# EasyEDA schematic SCH_超级电容测控板3.json

## Sheets
1 Sheet_1: TITLE: Sheet_1; REV: 1.0; Date: 2022-09-17; Sheet: 1/1; Drawn By: liuyiheng; Company: Your Company
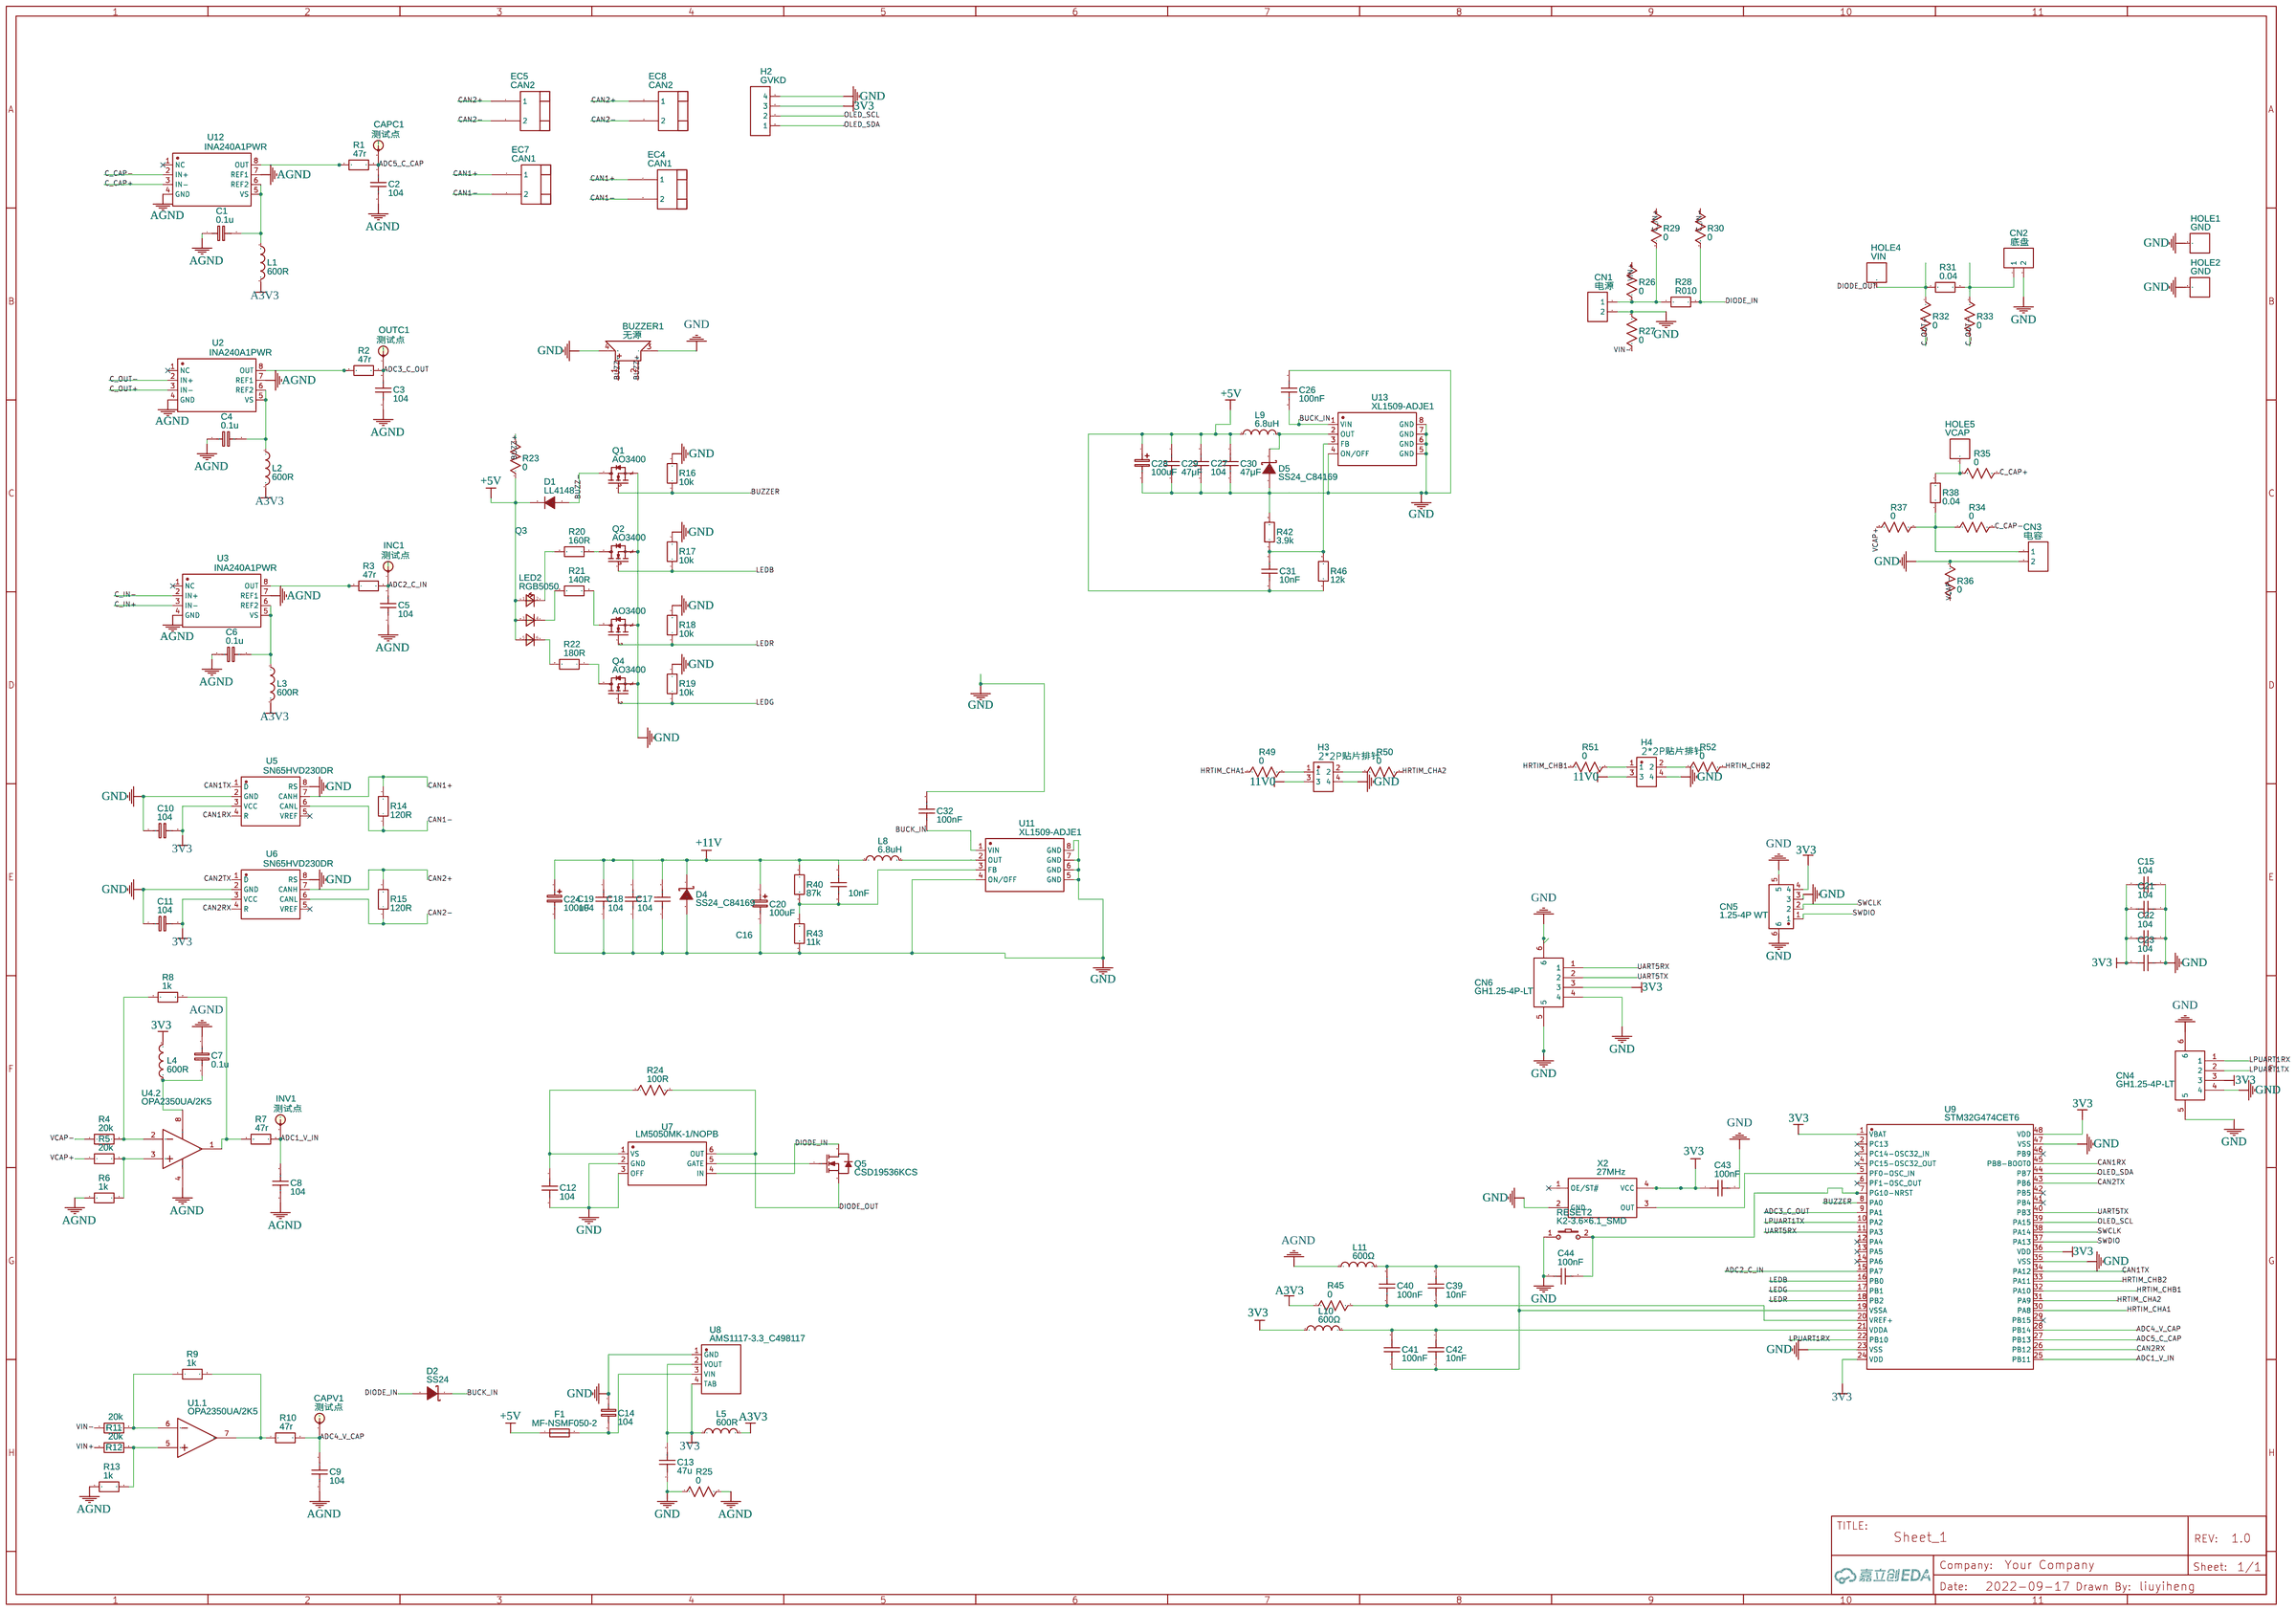
[diagram p0: Sheet_1]
2 参考DCDC: Date: 2021-09-21; Drawn By: sunhaoqin
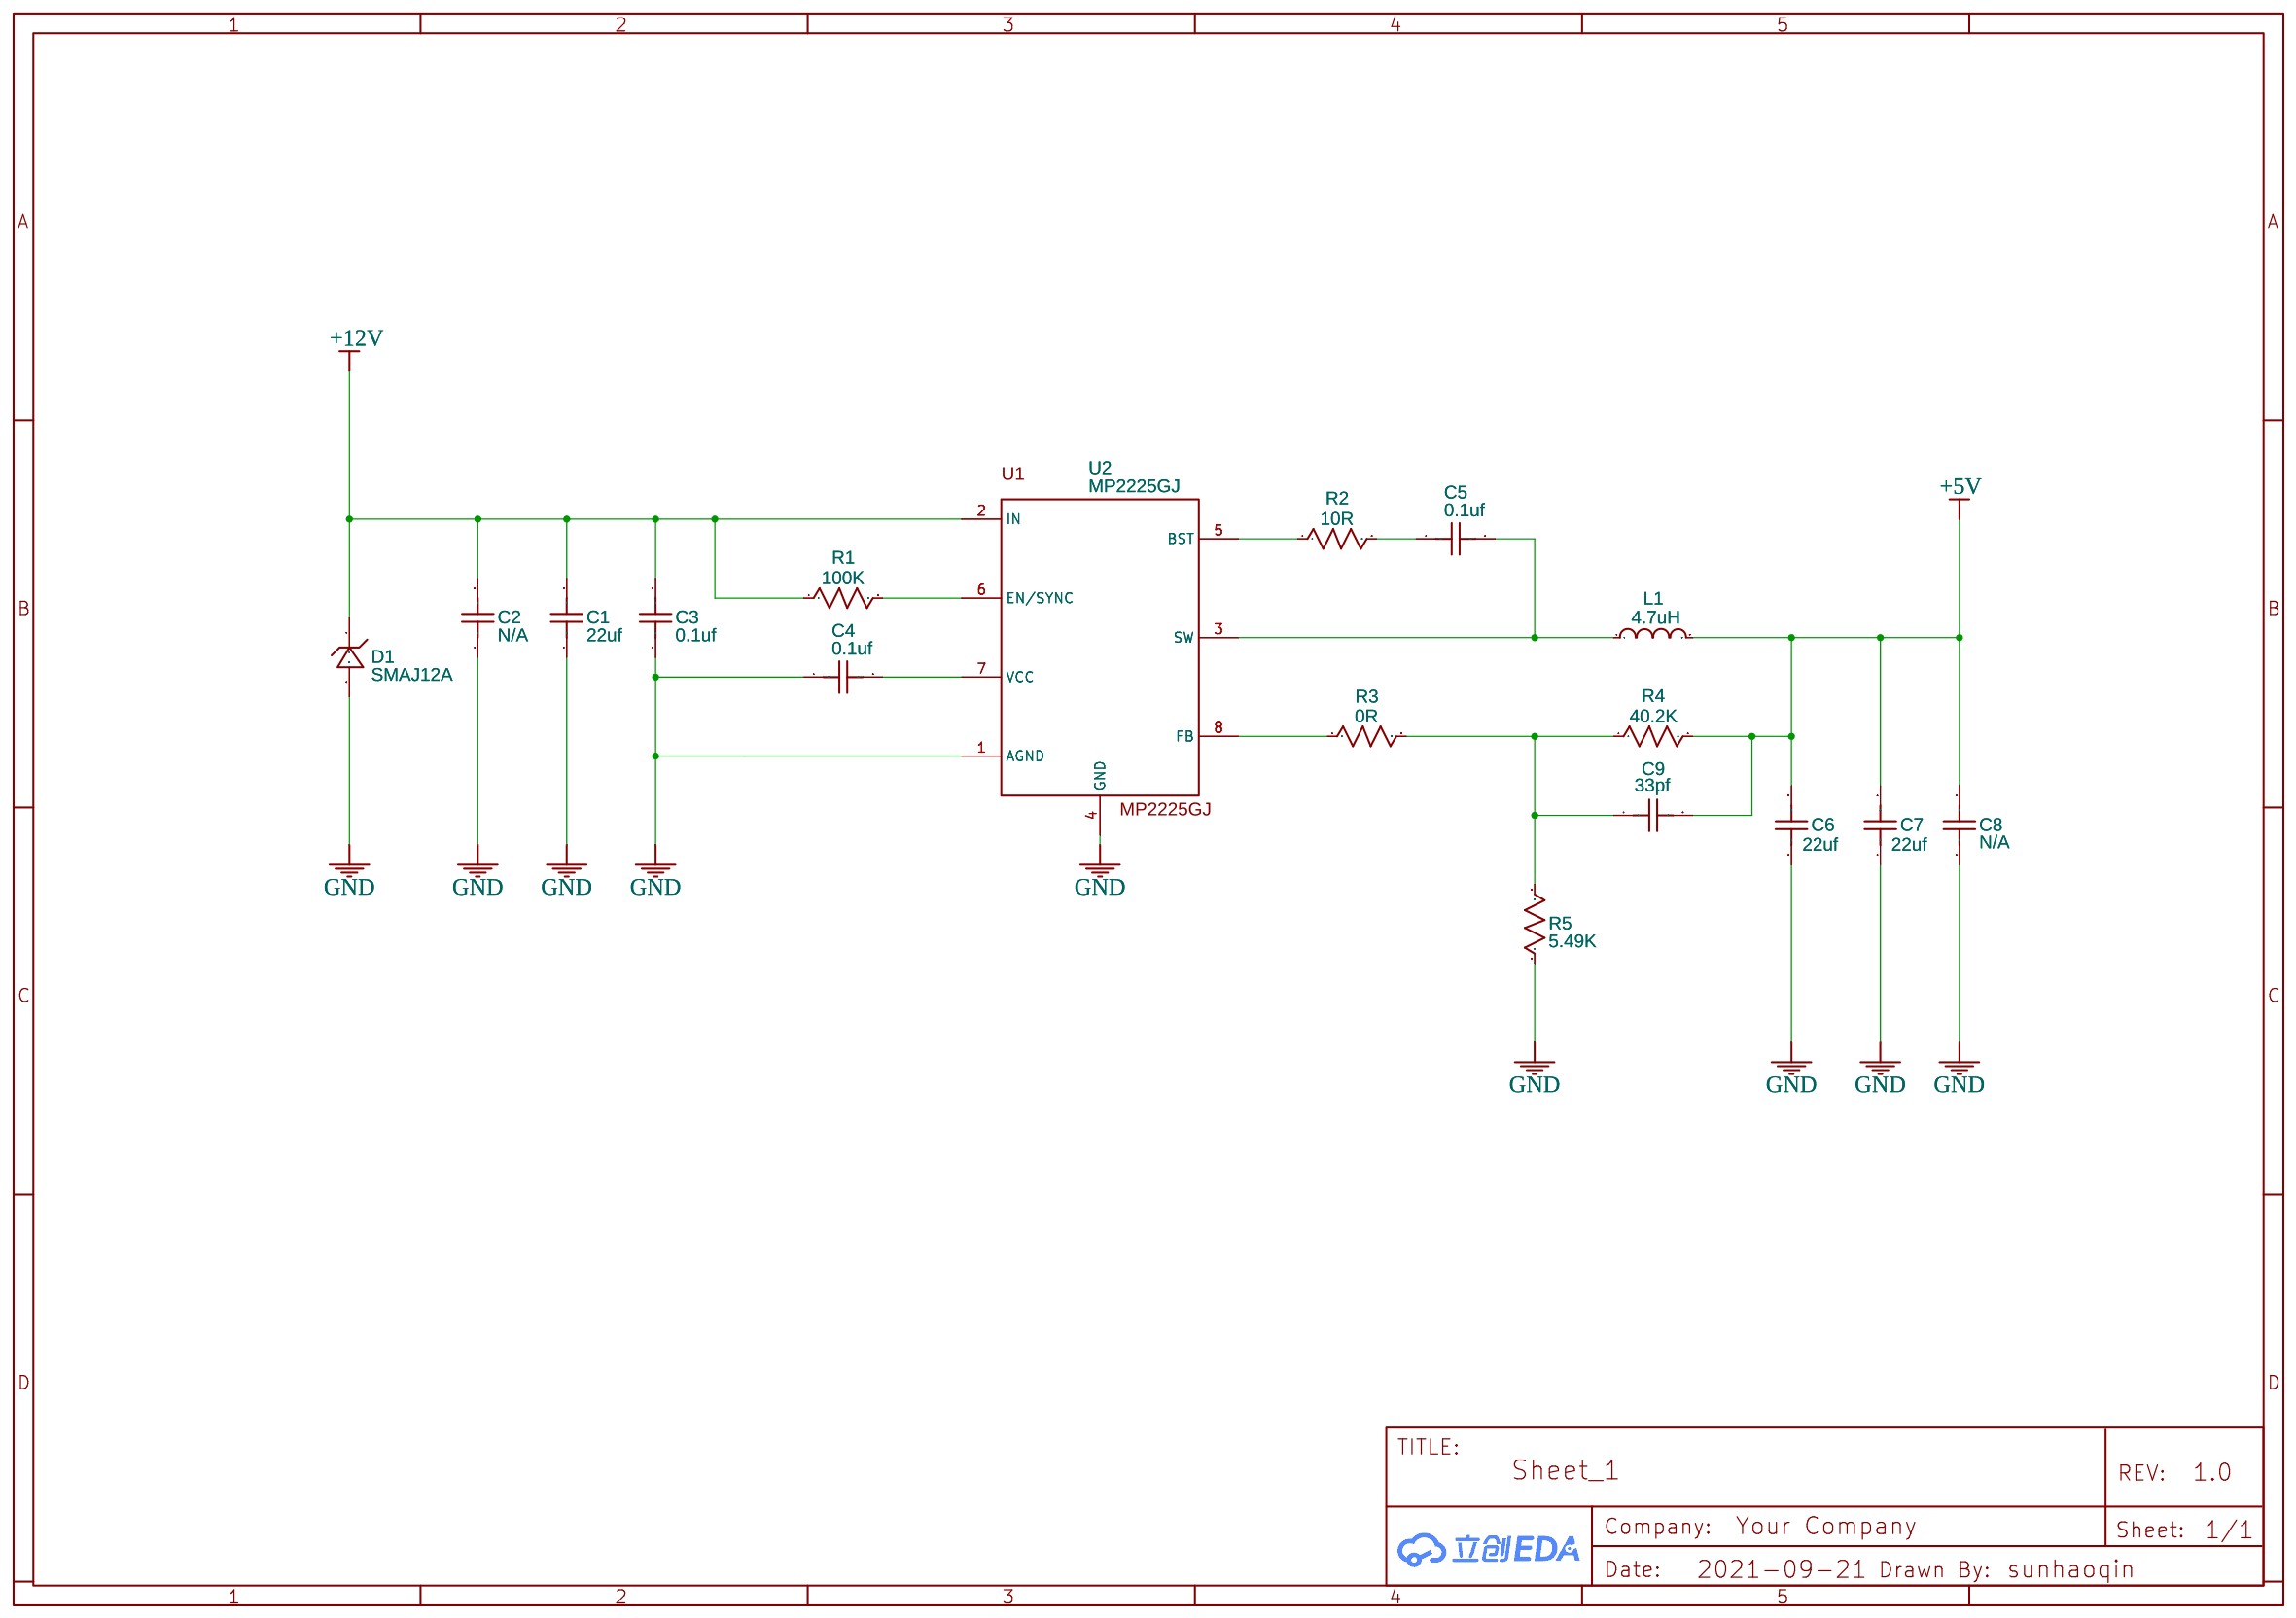
[diagram p1: 参考DCDC]

## Parts
sheet Sheet_1
BUZZER1  无源  [BUZ-SMD_GSC85XX]
C1  0.1u  [C0603]
C2  104  [C0603]
C3  104  [C0603]
C4  0.1u  [C0603]
C5  104  [C0603]
C6  0.1u  [C0603]
C7  0.1u  [C0603]
C8  104  [C0603]
C9  104  [C0603]
C10  104  [C0603]
C11  104  [C0603]
C12  104  [C0603]
C13  47u  [C0603]
C14  104  [C0603]
C15  104  [C0603]
C16  10nF  [C0603]
C17  104  [C0603]
C18  104  [C0603]
C19  104  [C0603]
C20  100uF  [CAP-SMD_L3.5-W2.8-R-RD]
C21  104  [C0603]
C22  104  [C0603]
C23  104  [C0603]
C24  100uF  [CAP-SMD_L3.5-W2.8-R-RD]
C26  100nF  [C0603]
C27  104  [C0603]
C28  100uF  [CAP-SMD_L3.5-W2.8-R-RD]
C29  47μF  [C0805]
C30  47μF  [C0805]
C31  10nF  [C0603]
C32  100nF  [C0603]
C39  10nF  [C0603]
C40  100nF  [C0603]
C41  100nF  [C0603]
C42  10nF  [C0603]
C43  100nF  [C0603]
C44  100nF  [C0603]
CAPC1  测试点  [TP-1.5MM]
CAPV1  测试点  [TP-1.5MM]
CN1  电源  [CONN-TH_XT30UPB-F]
CN2  底盘  [CONN-TH_XT30UPB-F]
CN3  电容  [CONN-TH_XT30UPB-F]
CN4  GH1.25-4P-LT  [SMD-1.25MM-4P-JST-H4.05]
CN5  1.25-4P WT  [CONN-SMD_1.25-4PWT]
CN6  GH1.25-4P-LT  [SMD-1.25MM-4P-JST-H4.05]
D1  LL4148  [LL-34_L3.5-W1.5-R-RD]
D2  SS24  [SMA_L4.3-W2.6-LS5.2-RD]
D4  SS24_C84169  [DO-214AC_L4.3-W2.7-LS5.3-RD]
D5  SS24_C84169  [DO-214AC_L4.3-W2.7-LS5.3-RD]
EC4  CAN1  [CON_GH1.25-1X2_SMD]
EC5  CAN2  [CON_GH1.25-1X2_SMD]
EC7  CAN1  [CON_GH1.25-1X2_SMD]
EC8  CAN2  [CON_GH1.25-1X2_SMD]
F1  MF-NSMF050-2  [F1206]
H2  GVKD  [HDR-F-2.54_1X4]
H3  2*2P贴片排针  [HDR-SMD_4P-P2.54-V-M-R2-C5-S7.4]
H4  2*2P贴片排针  [HDR-SMD_4P-P2.54-V-M-R2-C5-S7.4]
HOLE1  GND  [HOLE_3MM]
HOLE2  GND  [HOLE_3MM]
HOLE4  VIN  [HOLE_3MM]
HOLE5  VCAP  [HOLE_3MM]
INC1  测试点  [TP-1.5MM]
INV1  测试点  [TP-1.5MM]
L1  600R  [L0603]
L2  600R  [L0603]
L3  600R  [L0603]
L4  600R  [L0603]
L5  600R  [L0603]
L8  6.8uH  [IND-SMD_L10.0-W9.0]
L9  6.8uH  [IND-SMD_L10.0-W9.0]
L10  600Ω  [L0805]
L11  600Ω  [L0805]
LED2  RGB5050  [RGB5050]
OUTC1  测试点  [TP-1.5MM]
Q1  AO3400  [SC-59-3_L2.9-W1.5-P0.95-LS2.5-BR]
Q2  AO3400  [SC-59-3_L2.9-W1.5-P0.95-LS2.5-BR]
Q3  AO3400  [SC-59-3_L2.9-W1.5-P0.95-LS2.5-BR]
Q4  AO3400  [SC-59-3_L2.9-W1.5-P0.95-LS2.5-BR]
Q5  CSD19536KCS  [TO-220-3_L10.0-W4.5-P2.54-L]
R1  47r  [R0603]
R2  47r  [R0603]
R3  47r  [R0603]
R4  20k  [R0603]
R5  20k  [R0603]
R6  1k  [R0603]
R7  47r  [R0603]
R8  1k  [R0603]
R9  1k  [R0603]
R10  47r  [R0603]
R11  20k  [R0603]
R12  20k  [R0603]
R13  1k  [R0603]
R14  120R  [R0603]
R15  120R  [R0603]
R16  10k  [R0603]
R17  10k  [R0603]
R18  10k  [R0603]
R19  10k  [R0603]
R20  160R  [R0603]
R21  140R  [R0603]
R22  180R  [R0603]
R23  0  [2-短路点]
R24  100R  [R0603]
R25  0  [2-短路点]
R26  0  [2-短路点]
R27  0  [2-短路点]
R28  R010  [R2512]
R29  0  [2-短路点]
R30  0  [2-短路点]
R31  0.04  [R2512]
R32  0  [2-短路点]
R33  0  [2-短路点]
R34  0  [2-短路点]
R35  0  [2-短路点]
R36  0  [2-短路点]
R37  0  [2-短路点]
R38  0.04  [R2512]
R40  87k  [R0603]
R42  3.9k  [R0603]
R43  11k  [R0603]
R45  0  [2-短路点]
R46  12k  [R0603]
R49  0  [2-短路点]
R50  0  [2-短路点]
R51  0  [2-短路点]
R52  0  [2-短路点]
RESET2  K2-3.6×6.1_SMD  [KEY-SMD_2P-L6.2-W3.6-LS8.0]
U1  OPA2350UA/2K5  [SOIC-8_L4.9-W3.9-P1.27-LS6.0-BL]  (section 1)
U2  INA240A1PWR  [TSSOP-8_L4.4-W3.0-P0.65-LS6.4-BL]
U3  INA240A1PWR  [TSSOP-8_L4.4-W3.0-P0.65-LS6.4-BL]
U4  OPA2350UA/2K5  [SOIC-8_L4.9-W3.9-P1.27-LS6.0-BL]  (section 2)
U5  SN65HVD230DR  [SOIC-8_L4.9-W3.9-P1.27-LS6.0-BL]
U6  SN65HVD230DR  [SOIC-8_L4.9-W3.9-P1.27-LS6.0-BL]
U7  LM5050MK-1/NOPB  [TSOT-23-6_L2.9-W1.6-P0.95-LS2.8-BR]
U8  AMS1117-3.3_C498117  [PG-SOT223-4_L6.5-W3.5-P2.30-LS7.0-BR]
U9  STM32G474CET6  [LQFP-48_L7.0-W7.0-P0.50-LS9.0-BL]
U11  XL1509-ADJE1  [SOIC-8_L5.0-W4.0-P1.27-LS6.0-BL]
U12  INA240A1PWR  [TSSOP-8_L4.4-W3.0-P0.65-LS6.4-BL]
U13  XL1509-ADJE1  [SOIC-8_L5.0-W4.0-P1.27-LS6.0-BL]
X2  27MHz  [OSC-SMD_4P-L5.0-W3.2-BL_SG5032]
sheet 参考DCDC
C1#2  22uf  [C1206]
C2#2  N/A  [C1206]
C3#2  0.1uf  [C0603]
C4#2  0.1uf  [C0603]
C5#2  0.1uf  [C0603]
C6#2  22uf  [C0805]
C7#2  22uf  [C0805]
C8#2  N/A  [C0805]
C9#2  33pf  [C0603]
D1#2  SMAJ12A  [SMA_L4.4-W2.8-LS5.4-RD]
L1#2  4.7uH  [IND-SMD_L7.8-W7.0_MAPM0630F]
R1#2  100K  [R0603]
R2#2  10R  [R0603]
R3#2  0R  [R0603]
R4#2  40.2K  [R0603]
R5#2  5.49K  [R0603]
U2#2  MP2225GJ  [TSOT23-8]

## Library data of the parts
BUZZER1 = BUZZER_8530: Supplier: LCSC; Supplier Part: C9900004597; Manufacturer: null; Contributor: LCSC
C1 C4 C6 C7 C10 C11 C14 = C_0603_EU: Contributor: LCEDA_Lib
C2 C3 C3#2 C4#2 C5 C5#2 C8 C9 C9#2 C12 C13 = C_0603_US: Contributor: LCEDA_Lib
C15 C17-C19 C21-C23 C26 C27 C32 C40 C41 C43 C44 = CC0603KRX7R9BB104: Supplier: LCSC; Manufacturer: YAGEO; Supplier Part: C14663; Paste Type: base
C16 C31 = CC0603JRX7R8BB103: Supplier: LCSC; Supplier Part: C519510; Manufacturer: YAGEO; Contributor: LCSC
C20 C24 C28 = TCJB107M006R0040: Supplier: LCSC; Supplier Part: C597702; Manufacturer: AVX; Contributor: LCSC
C29 C30 = 47μF,±20%,25V,5MM-0805: Supplier: LCSC; Supplier Part: C9900003934; Manufacturer: null; Manufacturer Part: 47μF,±20%,25V,5mm-0805; JLCPCB Part Class: Extended Part; Contributor: LCSC
C39 C42 = C0603C103K1RAC3121: Supplier: LCSC; Supplier Part: C599638; Manufacturer: KEMET; Contributor: LCSC
CAPC1 CAPV1 INC1 INV1 OUTC1 = 测试点: Contributor: mylove3588
CN1 = XT30UPB-F: Supplier: LCSC; Supplier Part: C108769; Manufacturer: Changzhou Amass Elec; Contributor: hai98
CN2 CN3 = XT30UPB-F: Supplier: LCSC; Supplier Part: C108769; Manufacturer: Changzhou Amass Elec; Contributor: LCSC; JLCPCB Part Class: Extended Part
CN4 CN6 = GH1.25-4P-LT: Supplier: LCSC; Supplier Part: C161692; Manufacturer: JST Sales America; Manufacturer Part: BM04B-GHS-TBT(LF)(SN); Contributor: LCSC
CN5 = 1.25-4P WT: Supplier: LCSC; Supplier Part: C668615; Manufacturer: SHOU HAN; Contributor: LCSC; JLCPCB Part Class: Extended Part
D1 = LL4148: Supplier: LCSC; Manufacturer: SEMTECH; Supplier Part: C9808; JLCPCB Part Class: Basic Part
D2 = SS24: Supplier: LCSC; Manufacturer: MDD; Supplier Part: C50645; JLCPCB Part Class: Extended Part
D4 D5 = SS24_C84169: Supplier: LCSC; Manufacturer Part: SS24; Manufacturer: DYELEC; Supplier Part: C84169; JLCPCB Part Class: Extended Part
EC4 EC5 EC7 EC8 = CON-GH1.25-1X2: Finish: YES; JLC Supplier: C225118; MFG Name: JST; MFG Part Description: CONN SMT GH1.25 2P Vertical; MFG Part Lifecycle Phase: Production; MFG Part Number: A1257WV-S-2P; Number: 1; RoHS: YES; Comment: GH1.25-2P-WV; Contributor: windymsth
F1 = MF-NSMF050-2: Supplier: LCSC; Manufacturer: BOURNS; Supplier Part: C75464; JLCPCB Part Class: Extended Part
H2 = HDR-F-2.54_1x4: Supplier Part: C225501; Supplier: LCSC; Contributor: KDXDZ
H3 H4 = 2*2P贴片排针: Supplier: LCSC; Supplier Part: C780055; Manufacturer: XKB Connectivity; Manufacturer Part: X6521WVS-2*02H-C60D74; Contributor: LCSC
HOLE1 HOLE2 HOLE5 = hole-3mm: Manufacturer Part: hole-3; Contributor: SiGua
HOLE4 = HOLE-3MM COPY: Manufacturer Part: hole-3; Contributor: SiGua
L1-L5 = L0603_US: Contributor: LCEDA_Lib
L8 L9 = 6.8uH: Supplier: LCSC; Manufacturer: LCSC; Manufacturer Part: SM1054-6R8MT; Supplier Part: C11034
L10 L11 = PZ2012D601-R80TF: Supplier: LCSC; Manufacturer: Sunlord; Supplier Part: C74543
LED2 = RGB5050: Contributor: lisheng1255
Q1-Q4 = AO3400_C122850: Supplier: LCSC; Manufacturer: SK; Contributor: 立创EDA官方封装库; Supplier Part: C122850; JLCPCB Part Class: Extended Part
Q5 = CSD19536KCS: Supplier: LCSC; Supplier Part: C206030; Manufacturer: Texas Instruments; Contributor: LCSC; JLCPCB Part Class: Extended Part
R1-R22 R28 R31 R38 R40 R42 R43 R46 = R_0603_EU: Contributor: LCEDA_Lib
R1#2 R2#2 R3#2 R4#2 R5#2 R23-R27 R29 R30 R32-R37 R45 R49-R52 = R_0603_US: Contributor: LCEDA_Lib
RESET2 = K2-3.6×6.1_SMD: Supplier Part: C118141; Supplier: LCSC; Manufacturer Part: K2-1107ST-A4SW-06; Contributor: luochongbo; 制造商: 韩国韩荣
U1 U4 = OPA2350UA/2K5: Supplier Part: C55904; Supplier: LCSC; Manufacturer Part: TI; subpart_no: 1; image: http://image.lceda.cn/szlcsc/C55904.jpg; JLCPCB Part Class: Extended Part
U2 U3 U12 = INA240A1PWR: Supplier: LCSC; Manufacturer: TI; Contributor: LCSC; Supplier Part: C93965; JLCPCB Part Class: Extended Part
U5 U6 = SN65HVD230DR: Supplier: LCSC; Manufacturer: TI; Supplier Part: C12084; JLCPCB Part Class: Basic Part
U7 = LM5050MK-1/NOPB: Supplier: LCSC; Manufacturer: TI; Contributor: LCSC; Supplier Part: C129323; JLCPCB Part Class: Extended Part
U8 = AMS1117-3.3_C498117: Supplier: LCSC; Supplier Part: C498117; Manufacturer: HGC(Huaguan Semicon); Manufacturer Part: AMS1117-3.3; Contributor: LCSC; JLCPCB Part Class: Extended Part
U9 = STM32G474CET6: Supplier: LCSC; Supplier Part: C730125; Manufacturer: STMicroelectronics; Contributor: LCSC; JLCPCB Part Class: Extended Part
U11 U13 = XL1509-ADJE1: Supplier: LCSC; Manufacturer: XLSEMI; Supplier Part: C74192; JLCPCB Part Class: Basic Part
X2 = X1G004451000500: Supplier: LCSC; Manufacturer: EPSON; Supplier Part: C70546
C1#2 C2#2 = C_1206_US: Contributor: LCEDA_Lib
C6#2 C7#2 C8#2 = C_0805_US: Contributor: LCEDA_Lib
D1#2 = SMAJ70A: Supplier: LCSC; Supplier Part: C309908; Manufacturer: Brightking Elec (TAIWAN); Contributor: LCSC; JLCPCB Part Class: Extended Part
L1#2 = JSHC0630H-150M-G: Supplier: LCSC; Supplier Part: C334085; Manufacturer: Jinlai; Contributor: LCSC
U2#2 = MP2225GJ: link: https://www.monolithicpower.com/en/documentview/productdocument/index/version/2/document_type/Datasheet/lang/en/sku/MP2225GJ-Z/document_id/922/; Contributor: sunhaoqin

## Nets
3V3: C10.2 C11.2 C13.2 C15.2 C21.2 C22.2 C23.2 C43.1 CN4.3 CN5.4 CN6.3 H2.3 L4.2 L5.1 L10.1 U5.3(VCC) U6.3(VCC) U8.2(VOUT) U8.4(TAB) U9.1(VBAT) U9.24(VDD) U9.36(VDD) U9.48(VDD) X2.4(VCC)
11V0: H3.3 H4.3
+5V: C6#2.2 C7#2.2 C8#2.2 C9#2.2 C27.2 C28.1 C29.1 C30.1 C31.2 D1.2(K) F1.1 L1#2.2 L9.1 LED2.1(A) LED2.3(A) LED2.5(A) R4#2.2 R23.1 R46.1
+11V: C16.2 C17.2 C18.2 C19.2 C20.1 C24.1 D4.1(K) L8.1 R40.1
+12V: C1#2.2 C2#2.2 C3#2.2 D1#2.1 R1#2.1 U2#2.2(IN)
A3V3: L1.2 L2.2 L3.2 L5.2 R45.1
AGND: C1.1 C2.1 C3.1 C4.1 C5.1 C6.1 C7.2 C8.1 C9.1 L11.1 R6.1 R13.1 R25.2 U2.4(GND) U2.7(REF1) U3.4(GND) U3.7(REF1) U4.4(V-) U12.4(GND) U12.7(REF1)
GND: BUZZER1.3(4) BUZZER1.4(3) C1#2.1 C2#2.1 C3#2.1 C4#2.1 C6#2.1 C7#2.1 C8#2.1 C10.1 C11.1 C12.1 C13.1 C14.1 C15.1 C17.1 C18.1 C19.1 C20.2 C21.1 C22.1 C23.1 C24.2 C26.2 C27.1 C28.2 C29.2 C30.2 C32.2 C43.2 C44.1 CN1.1(2) CN2.2 CN3.2 CN4.4 CN4.5 CN4.6 CN5.3 CN5.5 CN5.6 CN6.4 CN6.5 CN6.6 D1#2.2 D4.2(A) D5.2(A) H2.4 H3.4 H4.4 HOLE1.1 HOLE2.1 Q1.2(S) Q2.2(S) Q3.2(S) Q4.2(S) R5#2.1 R16.2 R17.2 R18.2 R19.2 R25.1 R27.2 R36.2 R42.2 R43.2 RESET2.1 U2#2.1(AGND) U2#2.4(GND) U5.2(GND) U5.8(RS) U6.2(GND) U6.8(RS) U7.2(GND) U7.3(OFF) U8.1(GND) U9.23(VSS) U9.35(VSS) U9.47(VSS) U11.4(ON/OFF) U11.5(GND) U11.6(GND) U11.7(GND) U11.8(GND) U13.4(ON/OFF) U13.5(GND) U13.6(GND) U13.7(GND) U13.8(GND) X2.2(GND)
VIN+: R12.1 R26.2
VIN-: R11.1 R27.1
ADC1_V_IN: C8.2 INV1.1 R7.2 U9.25(PB11)
ADC2_C_IN: C5.2 INC1.1 R3.2 U9.15(PA7)
ADC3_C_OUT: C3.2 OUTC1.1 R2.2 U9.9(PA1)
ADC4_V_CAP: C9.2 CAPV1.1 R10.2 U9.28(PB14)
ADC5_C_CAP: C2.2 CAPC1.1 R1.2 U9.27(PB13)
BUCK_IN: C26.1 C32.1 D2.1(K) U11.1(VIN) U13.1(VIN)
BUZZ+: BUZZER1.2 R23.2
BUZZ-: BUZZER1.1 D1.1(A) Q1.3(D)
BUZZER: Q1.1(G) R16.1 U9.8(PA0)
C_CAP+: R35.2 U12.3(IN-)
C_CAP-: R34.2 U12.2(IN+)
C_IN+: R29.2 U3.3(IN-)
C_IN-: R30.2 U3.2(IN+)
C_OUT+: R32.1 U2.3(IN-)
C_OUT-: R33.1 U2.2(IN+)
CAN1+: EC4.1 EC7.1 R14.2 U5.7(CANH)
CAN1-: EC4.2 EC7.2 R14.1 U5.6(CANL)
CAN1RX: U5.4(R) U9.45(PB8-BOOT0)
CAN1TX: U5.1(D) U9.34(PA12)
CAN2+: EC5.1 EC8.1 R15.2 U6.7(CANH)
CAN2-: EC5.2 EC8.2 R15.1 U6.6(CANL)
CAN2RX: U6.4(R) U9.26(PB12)
CAN2TX: U6.1(D) U9.43(PB6)
DIODE_IN: D2.2(A) Q5.2(D) R28.2 R30.1 U7.4(IN)
DIODE_OUT: HOLE4.1 Q5.3(S) R24.2 R31.1 R32.2 U7.6(OUT)
HRTIM_CHA1: R49.1 U9.30(PA8)
HRTIM_CHA2: R50.2 U9.31(PA9)
HRTIM_CHB1: R51.1 U9.32(PA10)
HRTIM_CHB2: R52.2 U9.33(PA11)
LEDB: Q2.1(G) R17.1 U9.16(PB0)
LEDG: Q4.1(G) R19.1 U9.17(PB1)
LEDR: Q3.1(G) R18.1 U9.18(PB2)
LPUART1RX: CN4.1 U9.22(PB10)
LPUART1TX: CN4.2 U9.10(PA2)
OLED_SCL: H2.2 U9.39(PA15)
OLED_SDA: H2.1 U9.44(PB7)
SWCLK: CN5.2 U9.38(PA14)
SWDIO: CN5.1 U9.37(PA13)
UART5RX: CN6.1 U9.11(PA3)
UART5TX: CN6.2 U9.40(PB3)
VCAP+: R5.1 R37.2
VCAP-: R4.1 R36.1
Net-(C1-2): C1.2 L1.1 U12.5(VS) U12.6(REF2)
Net-(C4#2-2): C4#2.2 U2#2.7(VCC)
Net-(C4-2): C4.2 L2.1 U2.5(VS) U2.6(REF2)
Net-(C5#2-1): C5#2.1 R2#2.2
Net-(C5#2-2): C5#2.2 L1#2.1 U2#2.3(SW)
Net-(C6-2): C6.2 L3.1 U3.5(VS) U3.6(REF2)
Net-(C7-1): C7.1 L4.1 U4.8(V+)
Net-(C9#2-1): C9#2.1 R3#2.2 R4#2.1 R5#2.2
Net-(C12-2): C12.2 R24.1 U7.1(VS)
Net-(C14-2): C14.2 F1.2 U8.3(VIN)
Net-(C16-1): C16.1 R40.2 R43.1 U11.3(FB)
Net-(C31-1): C31.1 R42.1 R46.2 U13.3(FB)
Net-(C39-1): C39.1 C40.1 R45.2 U9.20(VREF+)
Net-(C39-2): C39.2 C40.2 C41.1 C42.1 L11.2 U9.19(VSSA)
Net-(C41-2): C41.2 C42.2 L10.2 U9.21(VDDA)
Net-(C44-2): C44.2 RESET2.2 U9.7(PG10-NRST)
Net-(CN1-2): CN1.2(1) R26.1 R28.1 R29.1
Net-(CN2-1): CN2.1 R31.2 R33.2
Net-(CN3-1): CN3.1 R34.1 R37.1 R38.1
Net-(D5-1): D5.1(K) L9.2 U13.2(OUT)
Net-(H3-1): H3.1 R49.2
Net-(H3-2): H3.2 R50.1
Net-(H4-1): H4.1 R51.2
Net-(H4-2): H4.2 R52.1
Net-(HOLE5-1): HOLE5.1 R35.1 R38.2
Net-(L8-2): L8.2 U11.2(OUT)
Net-(LED2-2): LED2.2(G) R20.2
Net-(LED2-4): LED2.4(R) R21.2
Net-(LED2-6): LED2.6(B) R22.2
Net-(Q2-3): Q2.3(D) R20.1
Net-(Q3-3): Q3.3(D) R21.1
Net-(Q4-3): Q4.3(D) R22.1
Net-(Q5-1): Q5.1(G) U7.5(GATE)
Net-(R1#2-2): R1#2.2 U2#2.6(EN/SYNC)
Net-(R1-1): R1.1 U12.8(OUT)
Net-(R2#2-1): R2#2.1 U2#2.5(BST)
Net-(R2-1): R2.1 U2.8(OUT)
Net-(R3#2-1): R3#2.1 U2#2.8(FB)
Net-(R3-1): R3.1 U3.8(OUT)
Net-(R4-2): R4.2 R8.1 U4.2(IN A-)
Net-(R5-2): R5.2 R6.2 U4.3(IN A+)
Net-(R7-1): R7.1 R8.2 U4.1(OUT A)
Net-(R9-1): R9.1 R11.2 U1.6(IN B-)
Net-(R9-2): R9.2 R10.1 U1.7(OUT B)
Net-(R12-2): R12.2 R13.2 U1.5(IN B+)
Net-(U9-5): U9.5(PF0-OSC_IN) X2.3(OUT)

Not connected (* = marked no-connect by the designer): U2 1(NC)*; U3 1(NC)*; U5 5(VREF)*; U6 5(VREF)*; U9 2(PC13)* 3(PC14-OSC32_IN)* 4(PC15-OSC32_OUT)* 6(PF1-OSC_OUT)* 12(PA4)* 13(PA5)* 14(PA6)* 29(PB15)* 41(PB4)* 42(PB5)* 46(PB9)*; U12 1(NC)*; X2 1(OE/ST#)*
